# Altium project MB1814.PrjPcb (part 3 of 3)
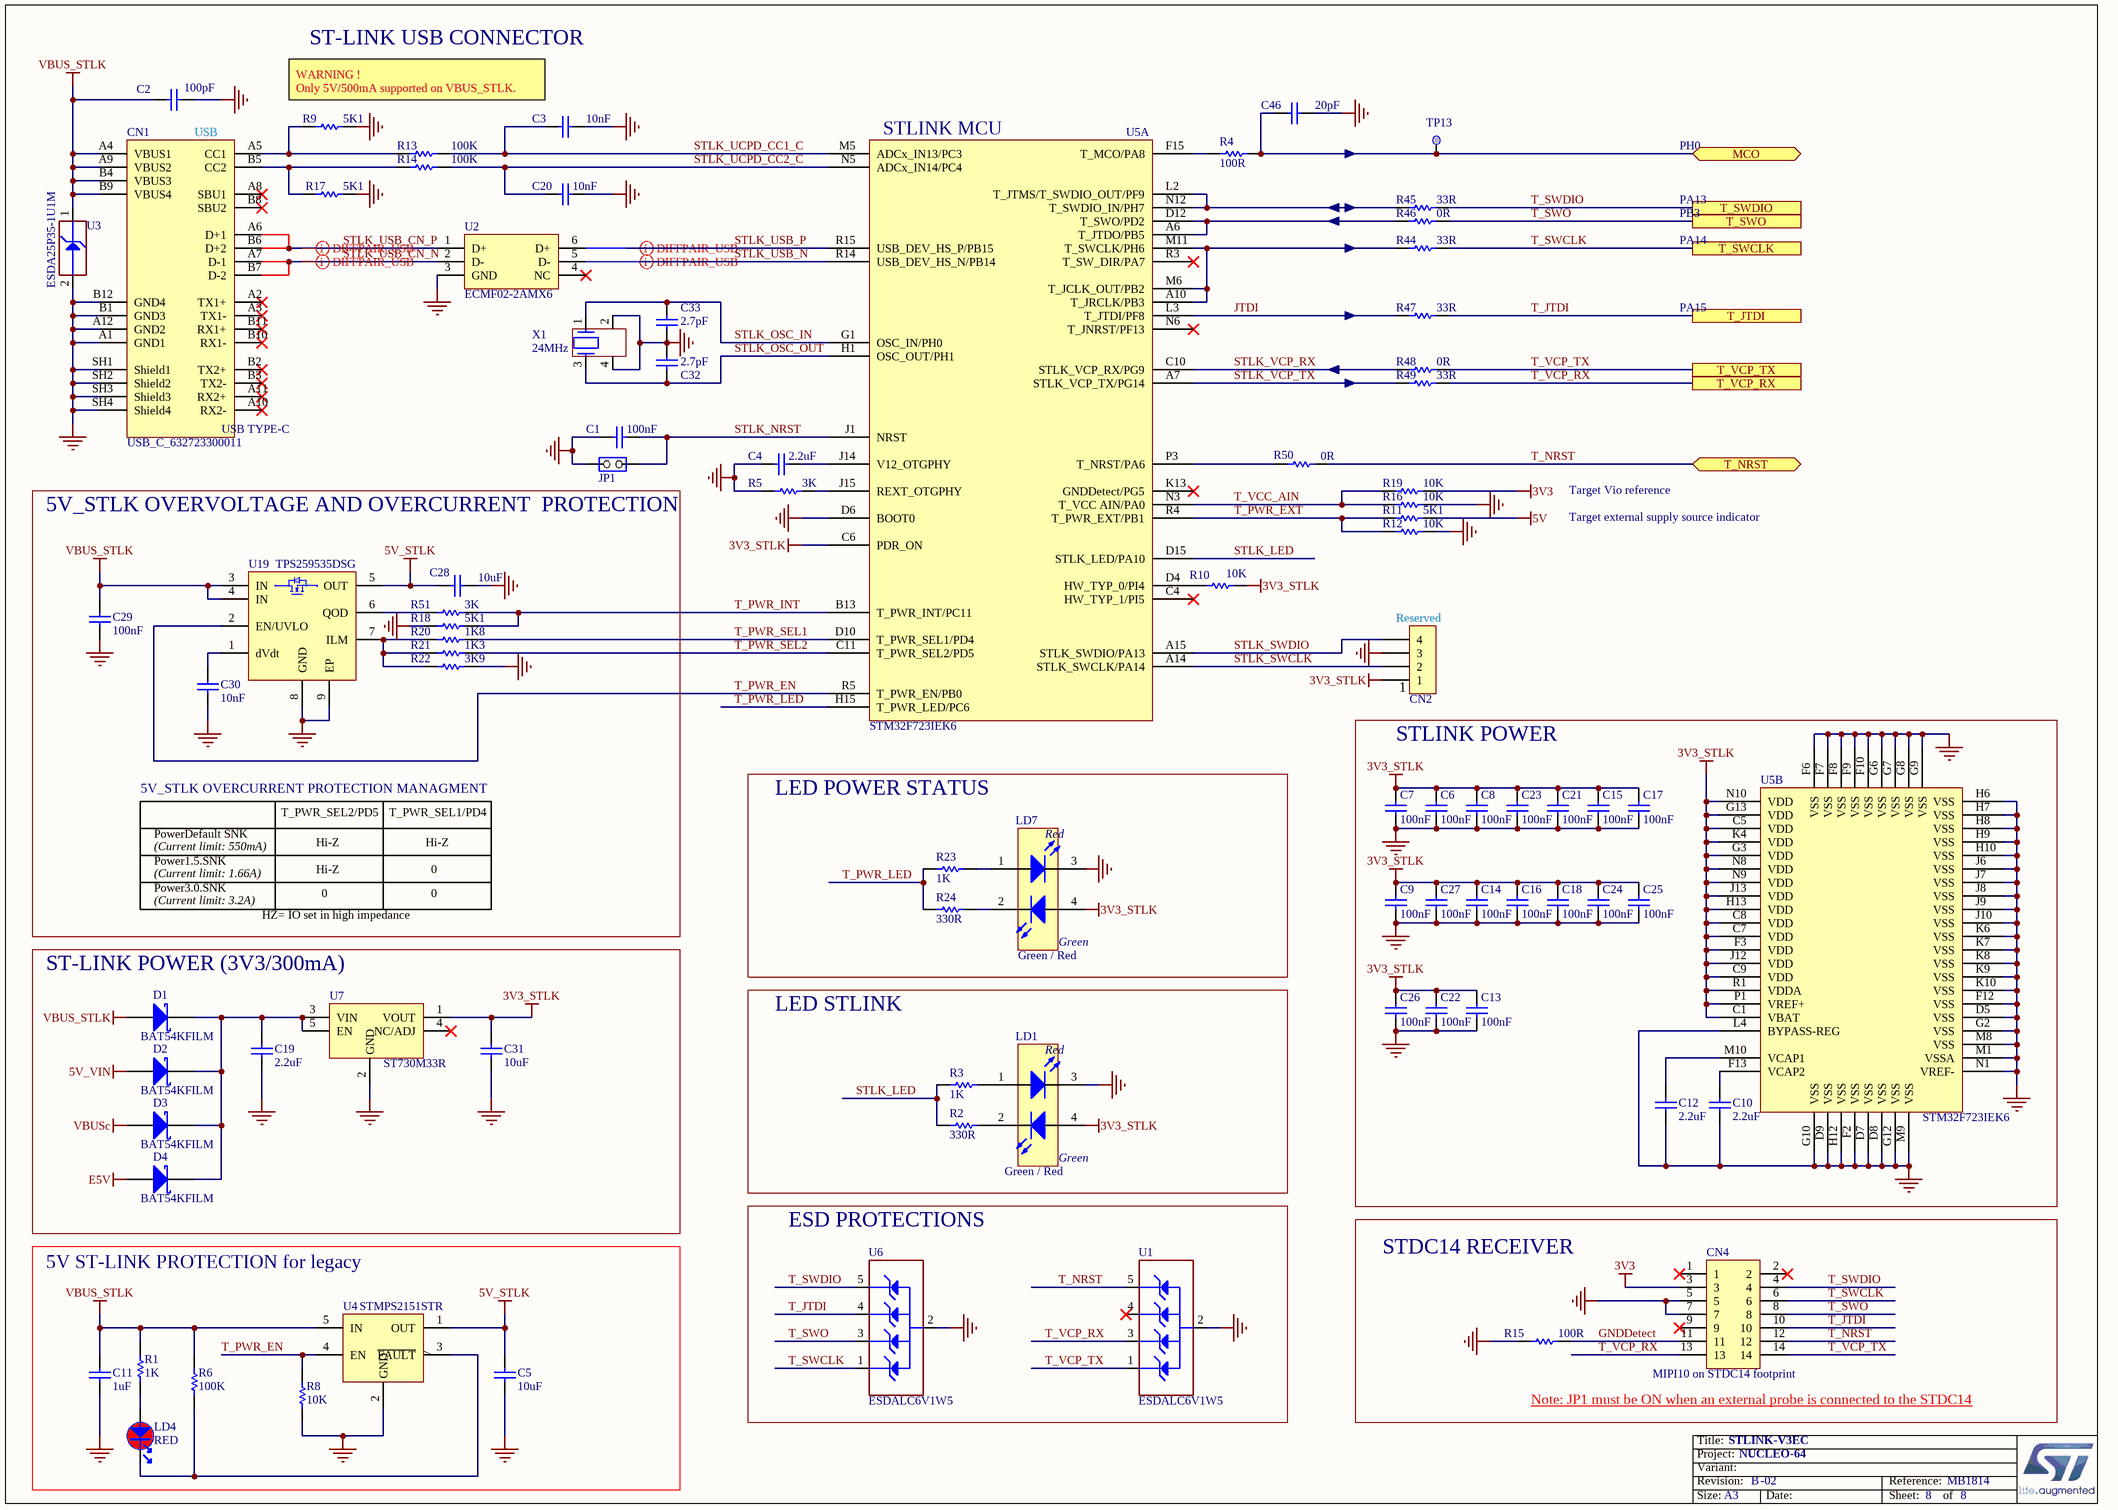
[diagram p8: ST_LINK_V3EC.SchDoc]

## Nets that join several sheets
3V3: Arduino_extension_connectors (CN6.4 CN7.16 R25.1 SB39.1), Power (JP6.1 SB5.2), USB (R36.2 R38.2 R40.1), ST_LINK_V3EC (CN4.3 R19.2)
5V: Arduino_extension_connectors (CN6.5 CN7.18), Power (10 pins), USB (R34.1 R42.1 U15.5), ST_LINK_V3EC (R11.2)
5V_STLK: Power (JP5.1), ST_LINK_V3EC (C5.2 C28.2 U4.1 U19.5)
5V_VIN: Arduino_extension_connectors (R30.2), Power (C38.2 JP5.3 U11.2 U11.4), ST_LINK_V3EC (D2.1)
AGND: Arduino_extension_connectors (CN10.32), STM32_microcontroller_power (C43.1 C44.1 SB11.2 U13.12)
AVDD: Arduino_extension_connectors (CN5.8 CN10.7), STM32_microcontroller_power (C43.2 C44.2 R33.2 U13.13)
E5V: Arduino_extension_connectors (CN7.6), Power (JP5.5), ST_LINK_V3EC (D4.1)
GND: Arduino_extension_connectors (11 pins), Power (14 pins), STM32_microcontroller_IOs (14 pins), STM32_microcontroller_power (13 pins), USB (16 pins), ST_LINK_V3EC (107 pins)
VBAT: Arduino_extension_connectors (CN7.33), STM32_microcontroller_power (C53.2 SB38.2 U13.1)
VBUS_STLK: Arduino_extension_connectors (CN10.8), Power (JP5.7), ST_LINK_V3EC (14 pins)
VBUSc: Power (JP5.9), USB (SB45.2), ST_LINK_V3EC (D3.1)
VDD: Arduino_extension_connectors (CN7.5), Power (JP6.2), STM32_microcontroller_IOs (B1.1 B1.2), STM32_microcontroller_power (JP2.1), USB (R37.1)
VIN: Arduino_extension_connectors (CN6.8 CN7.24), Power (C41.2 U11.3)
ARD_D0_RX: Arduino_extension_connectors (CN9.1 CN10.37), STM32_microcontroller_IOs (SB18.2 SB33.1)
ARD_D1_TX: Arduino_extension_connectors (CN9.2 CN10.35), STM32_microcontroller_IOs (SB19.1 SB22.2)
BOOT0: Arduino_extension_connectors (CN7.7), STM32_microcontroller_IOs (R31.2 U13.60)
MCO: STM32_microcontroller_IOs (SB27.1), ST_LINK_V3EC (C46.2 R4.2 TP13.1)
PA0: Arduino_extension_connectors (CN7.28 CN8.1), STM32_microcontroller_IOs (SB21.2 U13.14)
PA1: Arduino_extension_connectors (CN7.30 CN8.2), STM32_microcontroller_IOs (U13.15)
PA2: Arduino_extension_connectors (CN7.32 CN8.3), STM32_microcontroller_IOs (U13.16)
PA5: Arduino_extension_connectors (CN5.6 CN10.11 SB6.1), STM32_microcontroller_IOs (U13.21)
PA6: Arduino_extension_connectors (CN5.5 CN10.13), STM32_microcontroller_IOs (U13.22)
PA7: Arduino_extension_connectors (CN5.4 CN10.15), STM32_microcontroller_IOs (U13.23)
PA8: Arduino_extension_connectors (CN9.8 CN10.23), STM32_microcontroller_IOs (U13.41)
PA10: Arduino_extension_connectors (CN9.3 CN10.33), STM32_microcontroller_IOs (U13.43)
PA11: Arduino_extension_connectors (SB44.2), STM32_microcontroller_IOs (SB13.2 U13.44)
PA12: Arduino_extension_connectors (SB12.2), STM32_microcontroller_IOs (SB17.2 U13.45)
PA13: Arduino_extension_connectors (CN7.13), STM32_microcontroller_IOs (SB40.2 U13.46)
PA14: Arduino_extension_connectors (CN7.15), STM32_microcontroller_IOs (SB41.2 U13.49)
PA15: Arduino_extension_connectors (CN7.17), STM32_microcontroller_IOs (R32.2 U13.50)
PB0: Arduino_extension_connectors (CN7.34 CN8.4), STM32_microcontroller_IOs (U13.26)
PB1: Arduino_extension_connectors (CN10.24), STM32_microcontroller_IOs (U13.27)
PB2: Arduino_extension_connectors (CN10.22), STM32_microcontroller_IOs (U13.28)
PB3: Arduino_extension_connectors (CN9.4 CN10.31), STM32_microcontroller_IOs (SB15.1 U13.55)
PB4: Arduino_extension_connectors (CN9.6 CN10.27), STM32_microcontroller_IOs (U13.56)
PB5: Arduino_extension_connectors (CN9.5 CN10.29), STM32_microcontroller_IOs (U13.57)
PB6: Arduino_extension_connectors (CN5.10 CN10.3 SB37.2), STM32_microcontroller_IOs (U13.58)
PB7: Arduino_extension_connectors (CN5.9 CN10.5 SB34.2), STM32_microcontroller_IOs (U13.59)
PB8: Arduino_extension_connectors (CN10.36), STM32_microcontroller_IOs (U13.61)
PB10: Arduino_extension_connectors (CN9.7 CN10.25), STM32_microcontroller_IOs (U13.29)
PB12: Arduino_extension_connectors (CN10.16), STM32_microcontroller_IOs (U13.33)
PB13: Arduino_extension_connectors (CN10.30), STM32_microcontroller_IOs (U13.34)
PB14: Arduino_extension_connectors (CN10.28), STM32_microcontroller_IOs (SB19.2 SB20.2 U13.35)
PB15: Arduino_extension_connectors (CN10.26), STM32_microcontroller_IOs (SB23.2 SB33.2 U13.36)
PC0: Arduino_extension_connectors (SB36.1), STM32_microcontroller_IOs (U13.8)
PC1: Arduino_extension_connectors (SB35.1), STM32_microcontroller_IOs (U13.9)
PC2: Arduino_extension_connectors (CN7.35), STM32_microcontroller_IOs (U13.10)
PC3: Arduino_extension_connectors (CN7.37), STM32_microcontroller_IOs (U13.11)
PC4: Arduino_extension_connectors (CN10.34), STM32_microcontroller_IOs (U13.24)
PC5: Arduino_extension_connectors (CN10.6), STM32_microcontroller_IOs (U13.25)
PC6: Arduino_extension_connectors (CN5.2 CN10.19), STM32_microcontroller_IOs (U13.37)
PC7: Arduino_extension_connectors (CN5.1 CN10.21), STM32_microcontroller_IOs (U13.38)
PC8: Arduino_extension_connectors (CN10.2), STM32_microcontroller_IOs (U13.39)
PC9: Arduino_extension_connectors (CN5.3 CN10.17), STM32_microcontroller_IOs (U13.40)
PC10: Arduino_extension_connectors (CN7.1), STM32_microcontroller_IOs (SB43.2 U13.51)
PC11: Arduino_extension_connectors (CN7.2), STM32_microcontroller_IOs (U13.52)
PC12: Arduino_extension_connectors (CN7.3), STM32_microcontroller_IOs (U13.53)
PC13: Arduino_extension_connectors (CN7.23), STM32_microcontroller_IOs (SB16.2 U13.2)
PC14: Arduino_extension_connectors (CN7.25), STM32_microcontroller_IOs (SB32.1)
PC15: Arduino_extension_connectors (CN7.27), STM32_microcontroller_IOs (SB29.1)
PD2: Arduino_extension_connectors (CN7.4), STM32_microcontroller_IOs (SB42.1 U13.54)
PF0: Arduino_extension_connectors (CN7.29), STM32_microcontroller_IOs (SB28.1)
PF1: Arduino_extension_connectors (CN7.31), STM32_microcontroller_IOs (SB24.1)
T_JTDI: STM32_microcontroller_IOs (SB9.1), ST_LINK_V3EC (CN4.10 R47.2 U6.4)
T_NRST: Arduino_extension_connectors (CN6.3 CN7.14), STM32_microcontroller_IOs (5 pins), ST_LINK_V3EC (CN4.12 R50.2 U1.5)
T_SWCLK: STM32_microcontroller_IOs (SB41.1), ST_LINK_V3EC (CN4.6 R44.2 U6.1)
T_SWDIO: STM32_microcontroller_IOs (SB40.1), ST_LINK_V3EC (CN4.4 R45.2 U6.5)
T_SWO: STM32_microcontroller_IOs (SB15.2), ST_LINK_V3EC (CN4.8 R46.2 U6.3)
T_VCP_RX: STM32_microcontroller_IOs (SB2.2 SB23.1), ST_LINK_V3EC (CN4.13 R49.2 U1.3)
T_VCP_TX: STM32_microcontroller_IOs (SB3.2 SB20.1), ST_LINK_V3EC (CN4.14 R48.2 U1.1)
USB_FS_N: STM32_microcontroller_IOs (SB13.1), USB (CN3.A7 CN3.B7 U17.1 U17.6)
USB_FS_OVCR: STM32_microcontroller_IOs (SB42.2), USB (LD5.2 R37.2 U15.3)
USB_FS_P: STM32_microcontroller_IOs (SB17.1), USB (CN3.A6 CN3.B6 U17.3 U17.4)
USB_FS_PWR_EN: STM32_microcontroller_IOs (SB43.1), USB (R40.2 U15.4)
USB_VBUS: STM32_microcontroller_IOs (SB10.1), USB (9 pins)

## Assembly variants
H503RB: not fitted C28 C28 C29 C29 C30 C30 CN2 CN2 D2 D2 D3 D3 D4 D4 LD5 LD5 R18 R18 R20 R20 R21 R21 R22 R22 R34 R34 R36 R36 R37 R37 R40 R40 R42 R42 R51 R51 SB1 SB1 SB7 SB7 SB12 SB12 SB14 SB14 SB18 SB18 SB20 SB20 SB21 SB21 SB22 SB22 SB23 SB23 SB24 SB24 SB27 SB27 SB28 SB28 SB29 SB29 SB32 SB32 SB34 SB34 SB37 SB37 SB44 SB44 U15 U15 U19 U19